# EasyEDA Pro project 3轴5.2_-专业软件格式.eprj, schematic 3轴5.2-原理图-V3.2

## Sheets
1 3轴5.2-原理图-V3.2
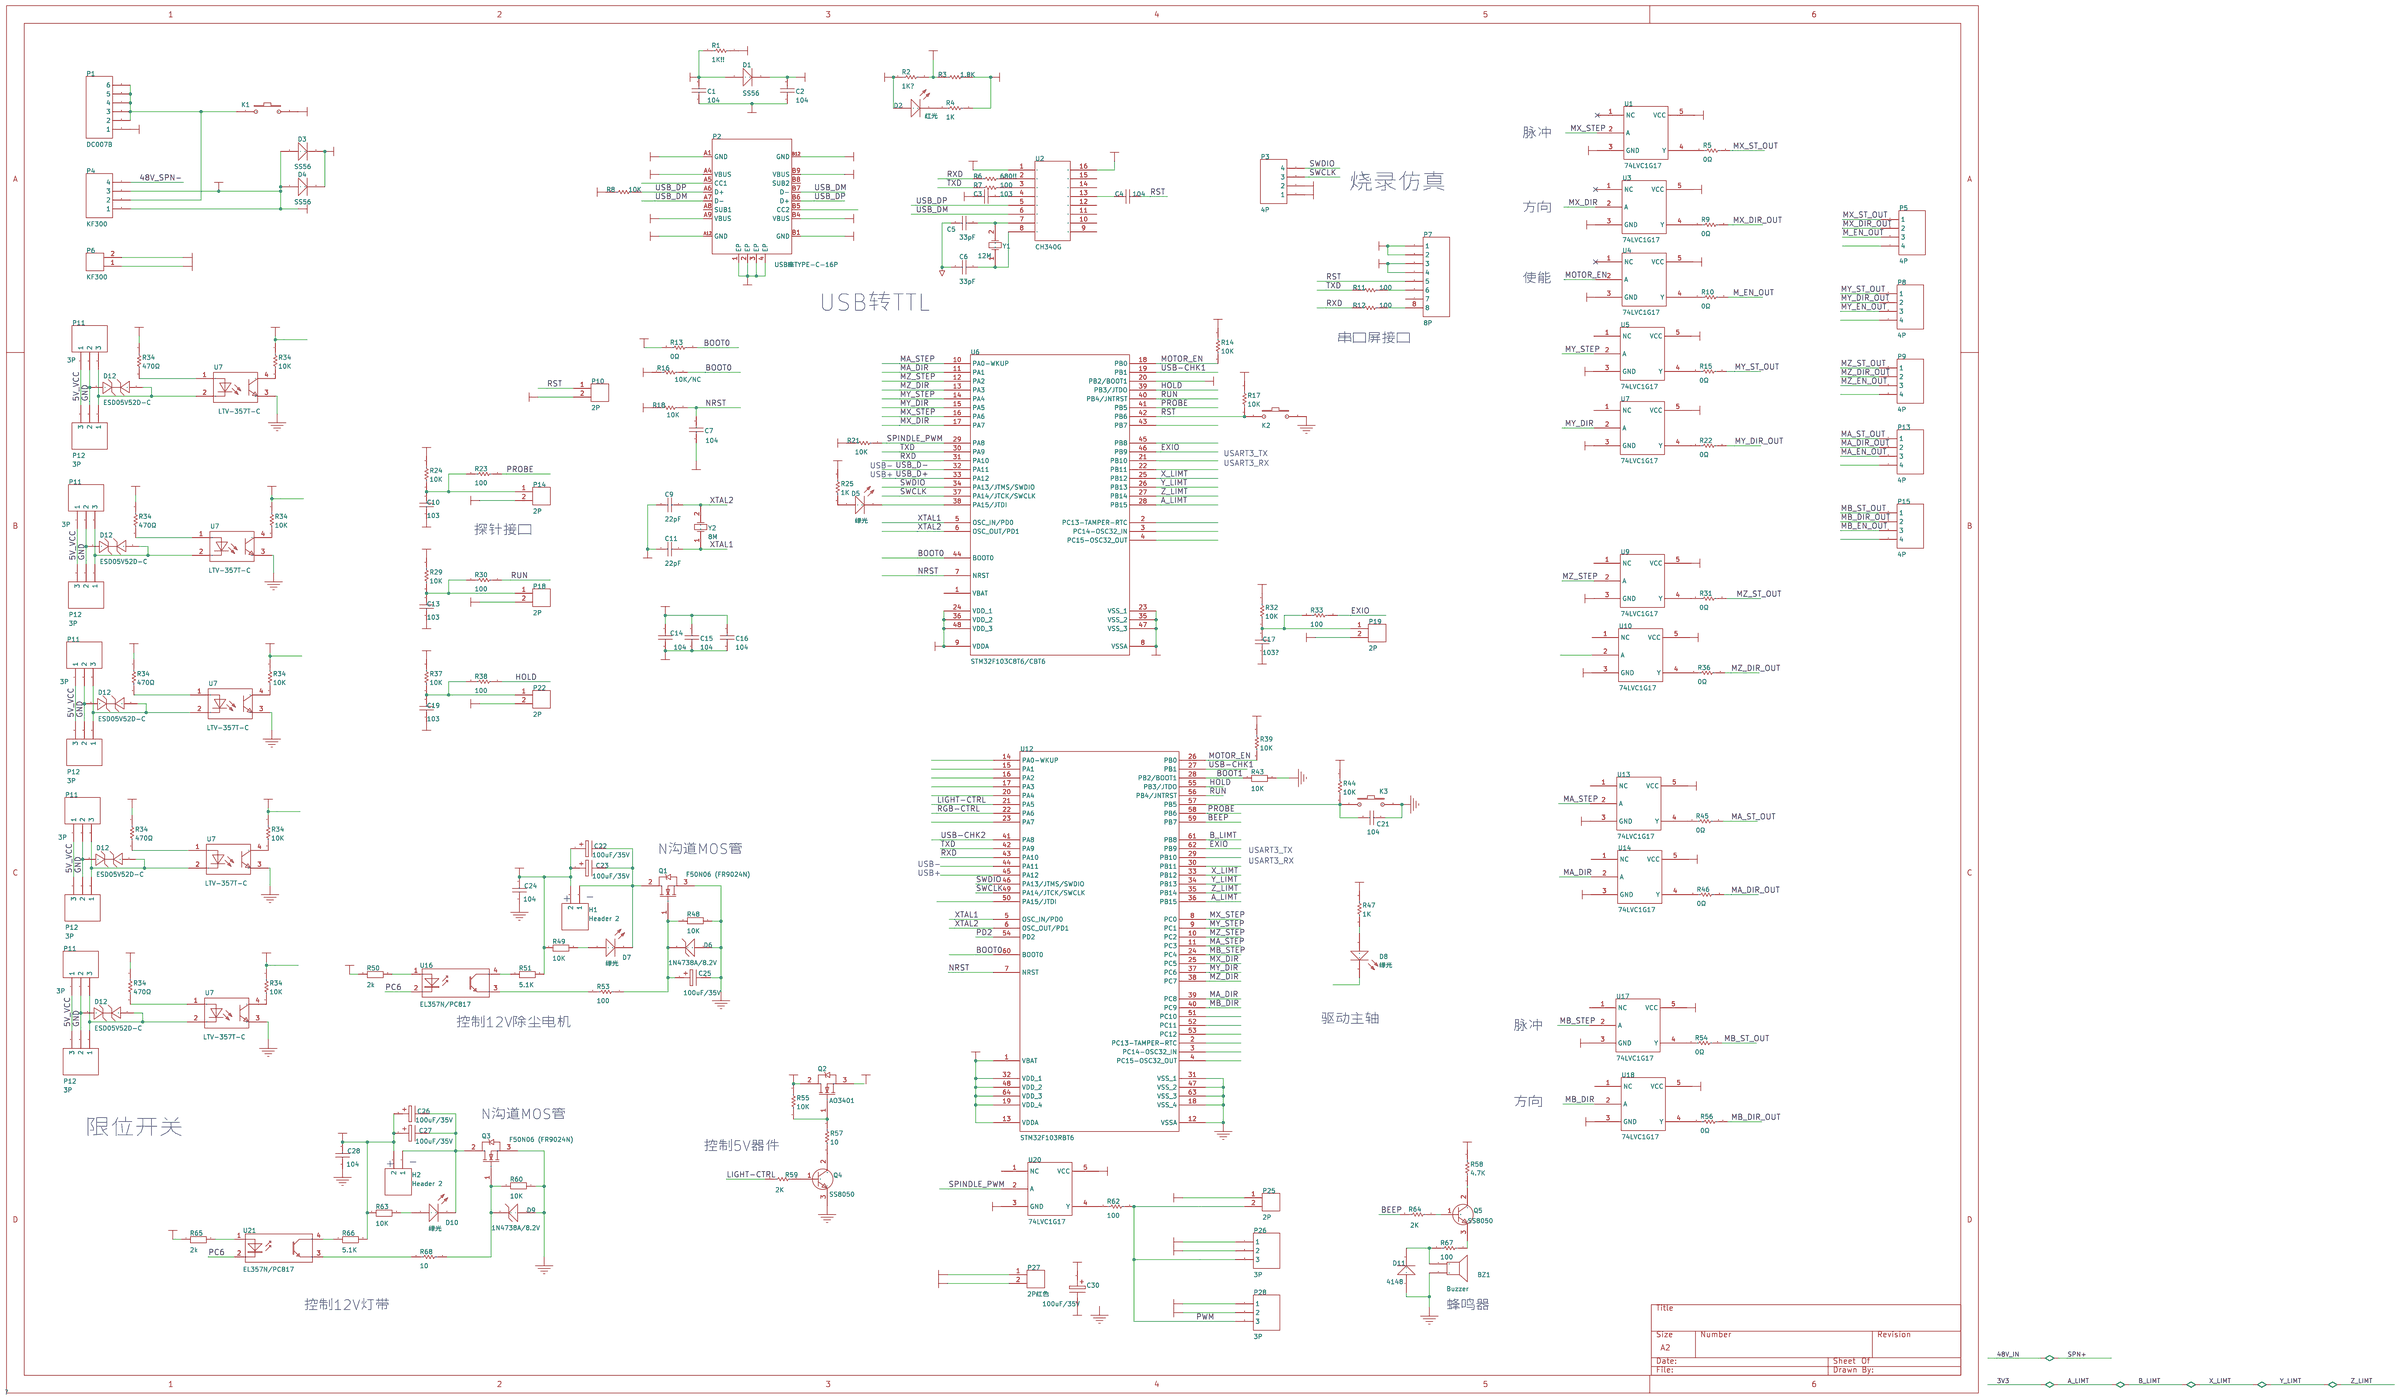
[diagram p0: 3轴5.2-原理图-V3.2]
2 电源部分
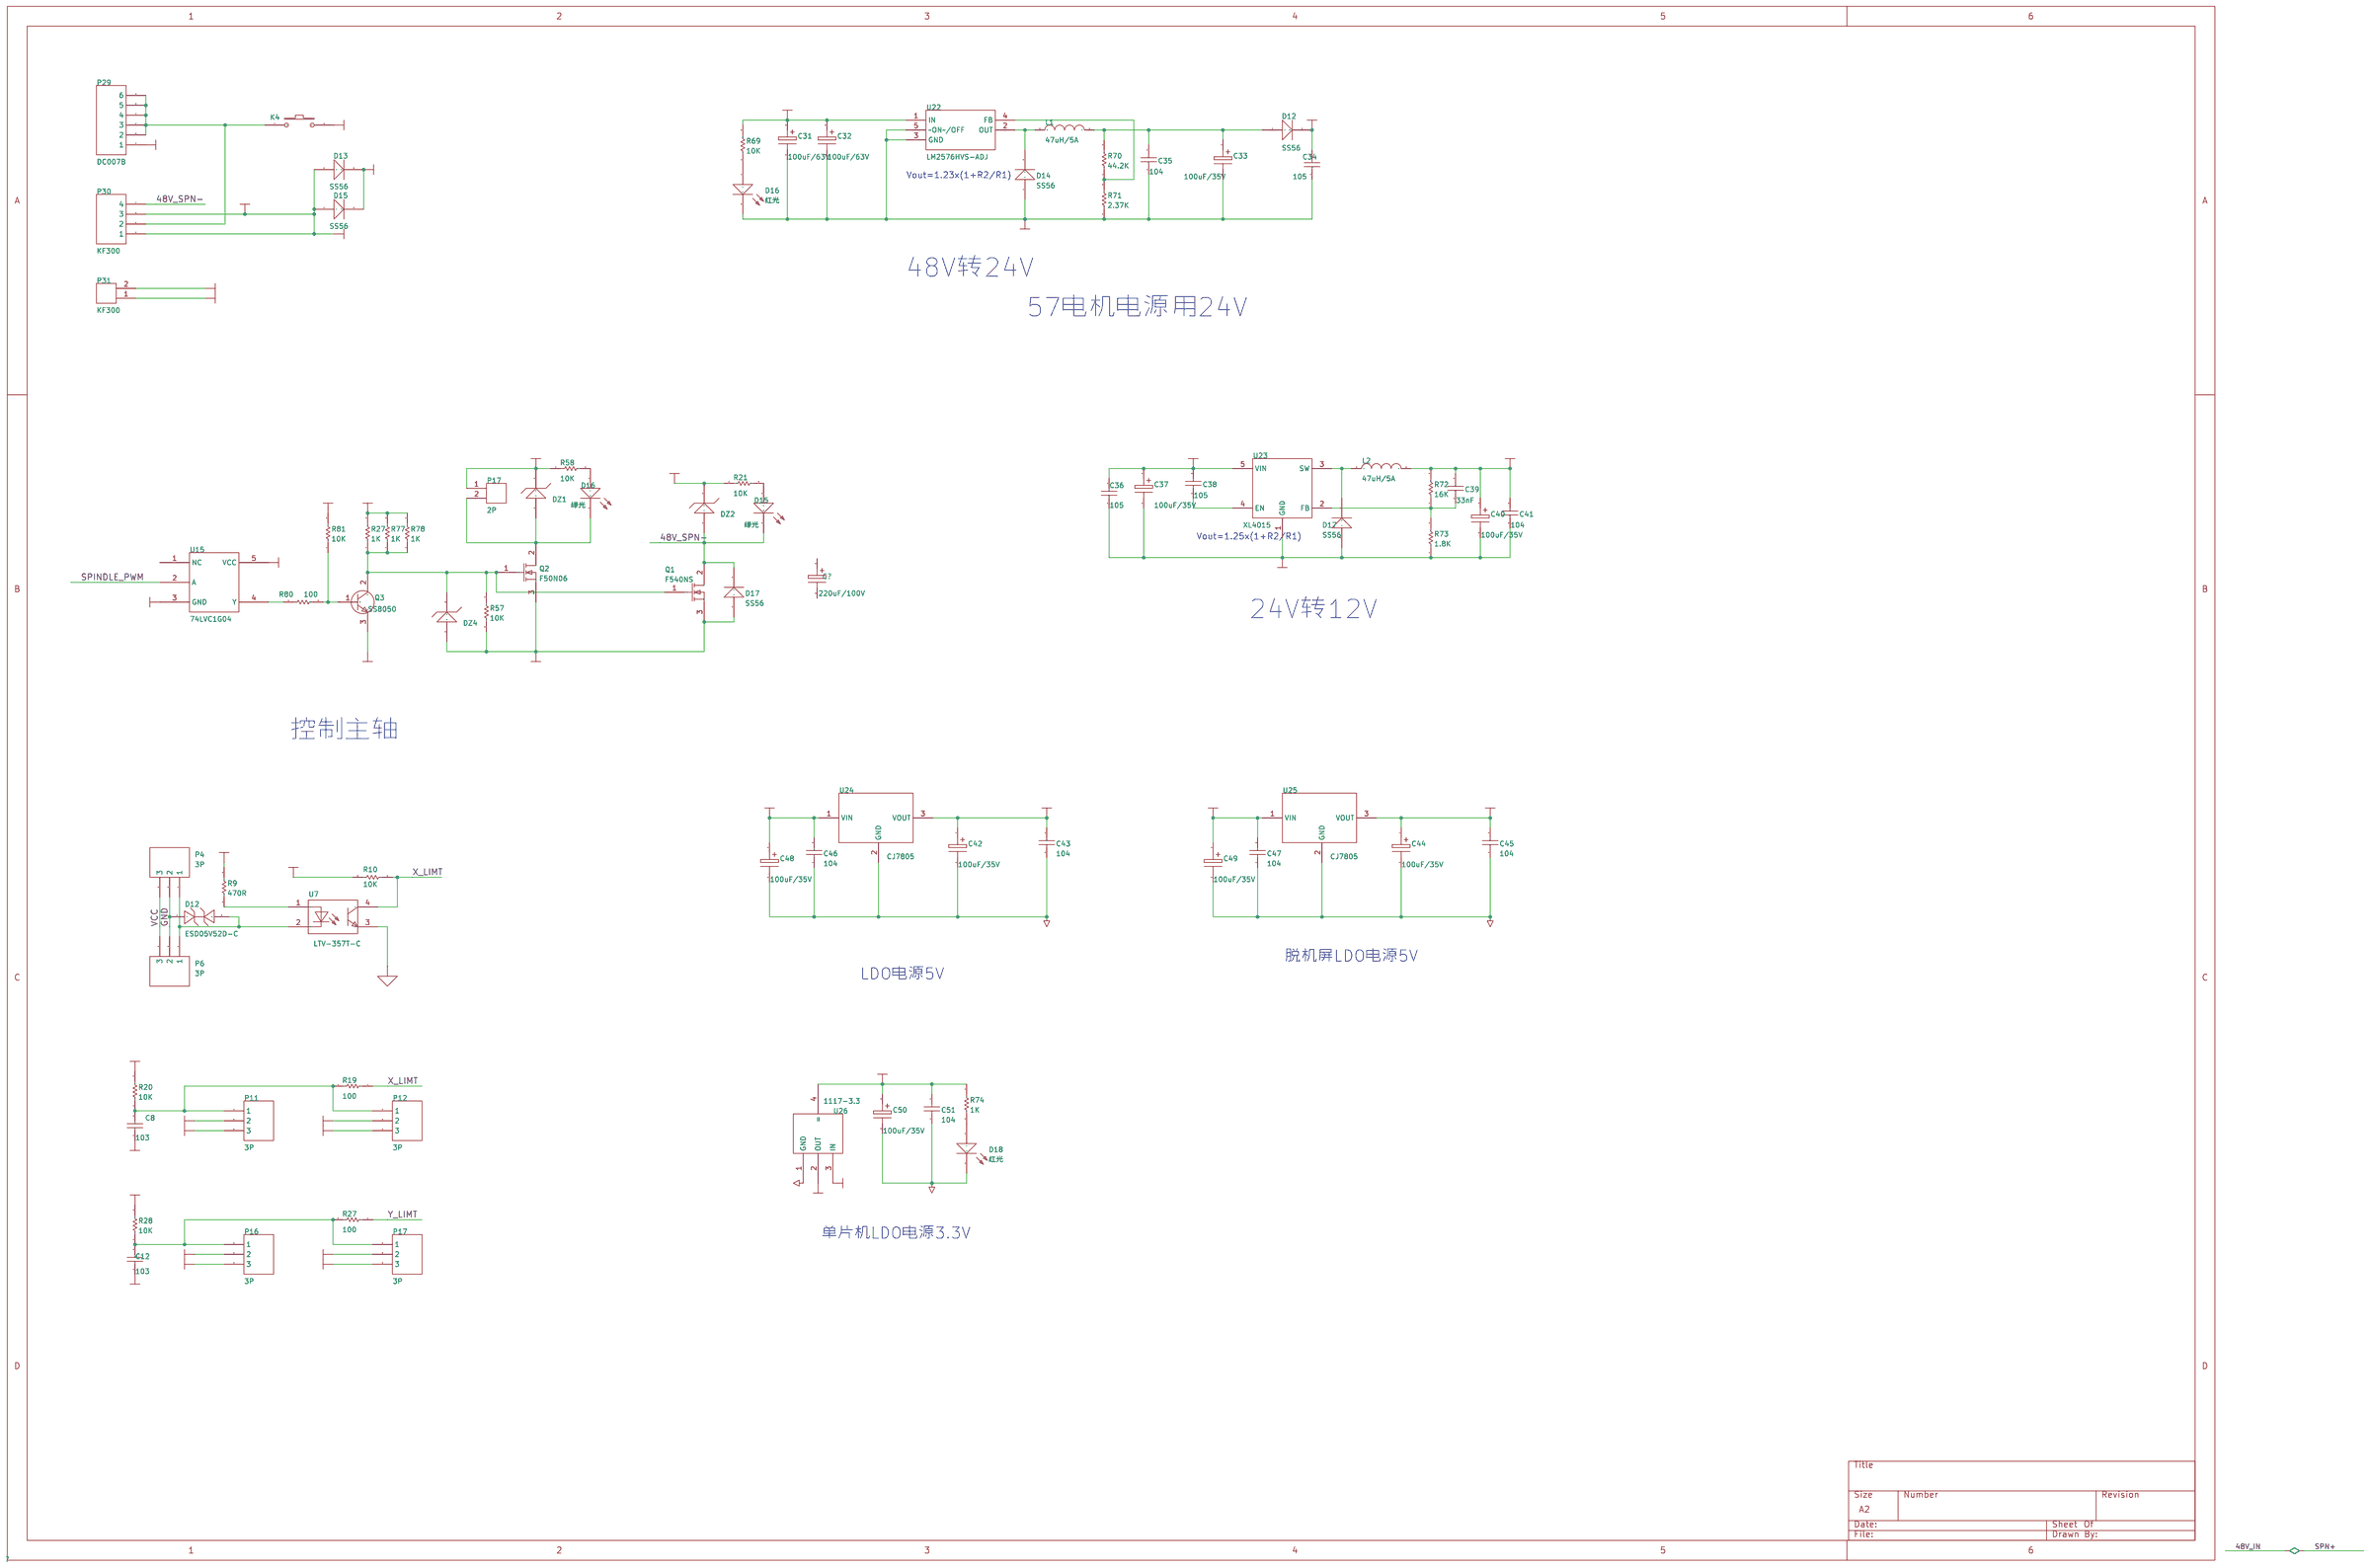
[diagram p1: 电源部分]

## Parts
sheet 3轴5.2-原理图-V3.2
BZ1  Buzzer
C1  104  [电解电容贴片10x10]
C2  104  [电解电容贴片10x10]
C3  103  [0603C]
C4  104  [0805C]
C5  18pF  [电解电容贴片6X6]
C6  18pF  [0603C]
C7  104  [电解电容贴片6X6]
C9  100pF  [0603C]
C10  103  [电解电容贴片6X6]
C11  100pF  [0603C]
C13  103  [电解电容贴片6X6]
C14  104  [0603C]
C15  104  [电解电容贴片6X6]
C16  104  [0603C]
C17  103?  [0603C]
C19  103  [0603C]
C21  104  [0603C]
C22  100uF/35V  [0603C]
C23  100uF/35V  [0603C]
C24  104  [电解电容贴片6x6]
C25  100uF/35V  [0603C]
C26  100uF/35V  [0603C]
C27  100uF/35V  [0603C]
C28  104  [0603C]
C30  100uF/35V  [0805C]
D1  SS56  [SMA]
D2  红光  [0603LED]
D3  SS56  [SMA]
D4  SS56  [0603LED]
D5  绿光  [SMA]
D6  1N4738A/8.2V  [SMA]
D7  绿光  [SMA]
D8  绿光  [0603LED]
D9  1N4738A/8.2V  [SMA]
D10  绿光  [0603LED]
D11  4148  [SMA]
D12  ESD05V52D-C
D12#2  ESD05V52D-C
D12#3  ESD05V52D-C
D12#4  ESD05V52D-C
D12#5  ESD05V52D-C
H1  Header 2
H2  Header 2
K1  开关按键  [船型开关KCD1-101]
K2  按键  [按键6x6贴片]
K3  按键  [按键6x6贴片]
P1  DC007B  [DC007B]
P2  USB座TYPE-C-16P  [直插座4P-KF300]
P3  4P  [HDR1X3_CON]
P4  KF300  [直插座4P-KF300]
P5  4P  [HDR1X2_CON]
P6  KF300  [直插座2P-KF300]
P7  8P  [HDR1X3_CON]
P8  4P  [HDR1X3_CON]
P9  4P  [HDR1X2_CON]
P10  2P  [USB_TYPEB]
P11  3P  [HDR1X3_CON]
P11#2  3P  [HDR1X3_CON]
P11#3  3P  [HDR1X3_CON]
P11#4  3P  [HDR1X3_CON]
P11#5  3P  [HDR1X3_CON]
P12  3P  [HDR1X3_CON]
P12#2  3P  [HDR1X3_CON]
P12#3  3P  [HDR1X3_CON]
P12#4  3P  [HDR1X3_CON]
P12#5  3P  [HDR1X3_CON]
P13  4P  [HDR1X2_CON]
P14  2P  [HDR1X3_CON]
P15  4P  [HDR1X4_CON]
P18  2P  [IDC8]
P19  2P  [HDR1X4_CON]
P22  2P  [HDR1X4_CON]
P25  2P  [HDR1X2_CON]
P26  3P  [HDR1X3_CON]
P27  2P红色  [直插座2P-KF300]
P28  3P  [HDR1X3_CON]
Q1  F50N06 (FR9024N)  [TO-252]
Q2  AO3401  [SOT-23]
Q3  F50N06 (FR9024N)  [TO-252]
Q4  SS8050  [SOT-23]
Q5  SS8050  [SOT-23]
R1  1K!!  [0603R]
R2  1K?  [0603R]
R3  1.8K  [0603R]
R4  1K  [0603R]
R5  0Ω  [0603R]
R6  680!!  [0603R]
R7  100  [0603R]
R8  10K  [0603R]
R9  0Ω  [0603R]
R10  0Ω  [0603R]
R11  100  [0603R]
R12  100  [0603R]
R13  0Ω  [0603R]
R14  10K  [0603R]
R15  0Ω  [0603R]
R16  10K/NC  [0603R]
R17  10K  [0603R]
R18  10K  [0603R]
R21  10K  [0603R]
R22  0Ω  [0603R]
R23  100  [0603R]
R24  10K  [0603R]
R25  1K  [0603R]
R29  10K  [0805R]
R30  100  [0805R]
R31  0Ω  [0805R]
R32  10K  [0805R]
R33  100  [0805R]
R34  10K  [0603R]
R34#2  470Ω  [0603R]
R34#3  10K  [0603R]
R34#4  470Ω  [0603R]
R34#5  10K  [0603R]
R34#6  470Ω  [0603R]
R34#7  10K  [0603R]
R34#8  470Ω  [0603R]
R34#9  10K  [0603R]
R34#10  470Ω  [0805R]
R36  0Ω  [0805R]
R37  10K  [0603R]
R38  100  [0603R]
R39  10K  [0603R]
R43  10K  [松下贴片电位器3x3]
R44  10K  [松下贴片电位器3x3]
R45  0Ω  [0603R]
R46  0Ω  [0603R]
R47  1K  [0603R]
R48  10K  [0603R]
R49  10K  [0603R]
R50  2k  [0603R]
R51  5.1K  [0603R]
R53  100  [0603R]
R54  0Ω  [0603R]
R55  10K  [0603R]
R56  0Ω  [0603R]
R57  10  [0603R]
R58  4.7K  [0603R]
R59  2K  [0603R]
R60  10K  [0603R]
R62  100  [0603R]
R63  10K  [0603R]
R64  2K  [0603R]
R65  2k  [0603R]
R66  5.1K  [0603R]
R67  100  [0603R]
R68  10  [0603R]
U1  74LVC1G17  [TO-263-2]
U2  CH340G  [TO-263]
U3  74LVC1G17  [TO-263]
U4  74LVC1G17  [LQFP48]
U5  74LVC1G17  [SOT-223]
U6  STM32F103C8T6/CBT6  [SOP16]
U7  74LVC1G17  [SOT-23-5]
U7#2  LTV-357T-C
U7#3  LTV-357T-C
U7#4  LTV-357T-C
U7#5  LTV-357T-C
U7#6  LTV-357T-C
U9  74LVC1G17  [QFN28]
U10  74LVC1G17  [QFN28]
U12  STM32F103RBT6
U13  74LVC1G17  [SOT-23-5]
U14  74LVC1G17  [SOT-23-5]
U16  EL357N/PC817  [SOT-23-5]
U17  74LVC1G17  [SOT-23-5]
U18  74LVC1G17  [SOT-23-5]
U20  74LVC1G17  [SOT-23-5]
U21  EL357N/PC817
Y1  12M  [晶振贴片49SSMD]
Y2  8M  [晶振贴片]
sheet 电源部分
C8  103  [0603C]
C12  103  [0805C]
C31  100uF/63V  [0805C]
C32  100uF/63V  [0805C]
C33  100uF/35V  [0805C]
C34  105  [电解电容贴片6X6]
C35  104  [电解电容贴片6X6]
C36  105  [电解电容贴片6X6]
C37  100uF/35V  [电解电容贴片6X6]
C38  105  [0603C]
C39  33nF  [0603C]
C40  100uF/35V  [0603C]
C41  104  [0603C]
C42  100uF/35V  [0603C]
C43  104  [0603C]
C44  100uF/35V  [0603C]
C45  104  [0603C]
C46  104  [0603C]
C47  104  [0603C]
C48  100uF/35V  [0603C]
C49  100uF/35V  [0603C]
C50  100uF/35V  [电解电容贴片6x6]
C51  104  [0603C]
C?#1  220uF/100V  [电解电容贴片6x6]
D12#6  SS56  [SMA]
D12#7  ESD05V52D-C  [0603LED]
D13  SS56  [0603LED]
D14  SS56  [SMA]
D15  SS56  [SMA]
D15#2  绿光  [0603LED]
D16  红光  [0603LED]
D16#2  绿光  [0603LED]
D17  SS56  [SMA]
D17#2  SS56  [SMA]
D18  红光  [SMA]
DZ1  快恢复二极管RS2M  [SMC]
DZ2  快恢复二极管RS2M  [SMC]
DZ4  稳压二极管SMAZ10V  [SMA]
K4  开关按键  [船型开关KCD1-101]
L1  47uH/5A  [电感贴片12X12]
L2  47uH/5A  [电感贴片12X12]
P4#2  3P  [HDR1X3_CON]
P6#2  3P  [HDR1X2_CON]
P11#6  3P  [HDR1X3_CON]
P12#6  3P  [HDR1X3_CON]
P16  3P  [HDR1X3_CON]
P17  2P  [VH3.96-2P直插座]
P17#2  3P  [VH3.96-2P直插座]
P29  DC007B  [DC007B]
P30  KF300  [HDR2X3]
P31  KF300  [直插座2P-KF300]
Q1#2  F540NS  [TO-263-2]
Q2#2  F50N06  [TO-252]
Q3#2  SS8050  [SOT-23]
R9#2  470R  [0603R]
R10#2  10K  [0603R]
R19  100  [0603R]
R20  10K  [0603R]
R21#2  10K  [0603R]
R27  1K  [0603R]
R27#2  100  [0603R]
R28  10K  [0603R]
R57#2  10K  [0603R]
R58#2  10K  [0603R]
R69  10K  [0603R]
R70  44.2K  [0603R]
R71  2.37K  [0603R]
R72  16K  [0603R]
R73  1.8K  [0603R]
R74  1K  [0603R]
R77  1K  [0603R]
R78  1K  [0603R]
R80  100  [0603R]
R81  10K  [0603R]
U7#7  LTV-357T-C
U15  74LVC1G04  [SOT-23-5]
U22  LM2576HVS-ADJ  [TO-263]
U23  XL4015  [TO-263]
U24  CJ7805  [TO-263-2]
U25  CJ7805  [TO-263-2]
U26  1117-3.3  [SOT-223]

## Library data of the parts
BZ1 = Buzzer: Loudspeaker; Published: 24-Mar-1999; LatestRevisionDate: 17-Jul-2002; LatestRevisionNote: Re-released for DXP Platform.; PackageReference: PIN2; Publisher: Altium Limited; Design Item ID: Speaker; Library Name: Miscellaneous Devices
C1 C2 C4 = 104: Capacitor (Semiconductor SIM Model); Published: 8-Jun-2000; LatestRevisionDate: 17-Jul-2002; LatestRevisionNote: Re-released for DXP Platform.; PackageReference: C1206; Publisher: Altium Limited; Origin Footprint 2: C1206; Origin Footprint 3: 0402; Origin Footprint 4: 1310[0504]; Origin Footprint 5: 1608[0603]; Origin Footprint 6: C1210; Origin Footprint 7: C0805; Origin Footprint 8: C1206; Origin Footprint 9: 0805; Origin Footprint 10: 0805L; Origin Footprint 1: 0603C; Design Item ID: Cap Semi; Library Name: Miscellaneous Devices
C3 = 103: Capacitor (Semiconductor SIM Model); Published: 8-Jun-2000; LatestRevisionDate: 17-Jul-2002; LatestRevisionNote: Re-released for DXP Platform.; PackageReference: C1206; Publisher: Altium Limited; Origin Footprint 2: C1206; Origin Footprint 3: 0402; Origin Footprint 4: 1310[0504]; Origin Footprint 5: 1608[0603]; Origin Footprint 6: C1210; Origin Footprint 7: C0805; Origin Footprint 8: C1206; Origin Footprint 9: 0805; Origin Footprint 10: 0805L; Design Item ID: Cap Semi; Library Name: Miscellaneous Devices
C5 = 33pF: Capacitor (Semiconductor SIM Model); Published: 8-Jun-2000; LatestRevisionDate: 17-Jul-2002; LatestRevisionNote: Re-released for DXP Platform.; PackageReference: C1206; Publisher: Altium Limited; Origin Footprint 2: C1206; Origin Footprint 3: 0402; Origin Footprint 4: 1310[0504]; Origin Footprint 5: 1608[0603]; Origin Footprint 6: C1210; Origin Footprint 7: C0805; Origin Footprint 8: C1206; Origin Footprint 9: 0805; Origin Footprint 10: 0805L; Origin Footprint 1: 0603C; Design Item ID: Cap Semi; Library Name: Miscellaneous Devices
C6 = 33pF: Capacitor (Semiconductor SIM Model); Published: 8-Jun-2000; LatestRevisionDate: 17-Jul-2002; LatestRevisionNote: Re-released for DXP Platform.; PackageReference: C1206; Publisher: Altium Limited; Origin Footprint 2: C1206; Origin Footprint 3: 0402; Origin Footprint 4: 1310[0504]; Origin Footprint 5: 1608[0603]; Origin Footprint 6: C1210; Origin Footprint 7: C0805; Origin Footprint 8: C1206; Origin Footprint 9: 0805; Origin Footprint 10: 0805L; Design Item ID: Cap Semi; Library Name: Miscellaneous Devices
C7 = 104: Capacitor (Semiconductor SIM Model); Published: 8-Jun-2000; LatestRevisionDate: 17-Jul-2002; LatestRevisionNote: Re-released for DXP Platform.; PackageReference: C1206; Publisher: Altium Limited; Origin Footprint 2: C1206; Origin Footprint 3: 0402; Origin Footprint 4: 1310[0504]; Origin Footprint 5: 1608[0603]; Origin Footprint 6: C1210; Origin Footprint 7: C0805; Origin Footprint 8: C1206; Origin Footprint 9: 0805; Origin Footprint 10: 0805L; Origin Footprint 11: 0805C; Origin Footprint 1: 0603C; Design Item ID: Cap Semi; Library Name: Miscellaneous Devices
C9 C11 = 22pF: Capacitor (Semiconductor SIM Model); Published: 8-Jun-2000; LatestRevisionDate: 17-Jul-2002; LatestRevisionNote: Re-released for DXP Platform.; PackageReference: C1206; Publisher: Altium Limited; Origin Footprint 2: C1206; Origin Footprint 3: 0402; Origin Footprint 4: 1310[0504]; Origin Footprint 5: 1608[0603]; Origin Footprint 6: C1210; Origin Footprint 7: C0805; Origin Footprint 8: C1206; Origin Footprint 9: 0805; Origin Footprint 10: 0805L; Origin Footprint 11: 0805C; Design Item ID: Cap Semi; Library Name: Miscellaneous Devices
C8 C10 C12 C13 C19 = 103: Design Item ID: CAP; Library Name: SCH封装库
C14 C16 C21 C28 C35 C41 = 104: Origin Footprint 2: CAP; Origin Footprint 3: 0805C; Design Item ID: CAP; Library Name: SCH封装库
C15 C24 = 104: Origin Footprint 2: CAP; Origin Footprint 3: 0805C; Origin Footprint 1: 0603C; Design Item ID: CAP; Library Name: SCH封装库
C17 = 103?: Design Item ID: CAP; Library Name: SCH封装库
C22 C23 C25-C27 C30 C33 C37 C40 C42 C44 C48 C49 = 100uF/35V: Origin Footprint 2: X47U; Origin Footprint 1: 电解电容贴片6x6; Design Item ID: ELECTRO1; Library Name: *
D1 D3 D4 D12#6 D13-D15 D17 D17#2 = SS56: Design Item ID: 1N4148; Library Name: SCH封装库
D2 D16 = 红光: Origin Footprint 2: LED(小); Design Item ID: LED; Library Name: SCH封装库
D5 D7 = 绿光: Origin Footprint 2: LED(小); Origin Footprint 1: 0603LED; Design Item ID: LED; Library Name: SCH封装库
D6 D9 = 1N4738A/8.2V: Zener Diode; Published: 8-Jun-2000; LatestRevisionDate: 17-Jul-2002; LatestRevisionNote: Re-released for DXP Platform.; PackageReference: DIODE-0.7; Publisher: Altium Limited; PackageDescription: Diode, Thru-Hole; 2 Leads; 0.7 in Pin Spacing; Design Item ID: D Zener; Library Name: Miscellaneous Devices
D8 D10 D15#2 D16#2 = 绿光: Origin Footprint 2: LED(小); Design Item ID: LED; Library Name: SCH封装库
D11 = 4148: Design Item ID: 1N4148; Library Name: SCH封装库
D12 D12#2-D12#5 D12#7 = ESD05V52D-C: 极性：双向 反向截止电压(Vrwm)：5V 击穿电压(VBR)：5.6V 钳位电压(Vc)@Ipp：15V 反向截止电压(Vrwm)：5V 击穿电压(最小值)：5.6V 峰值脉冲电流(Ipp)@tp=8/20μs：5A 最大钳位电压：15V; Supplier Part: C727170; Manufacturer: TWGMC(台湾迪嘉); Supplier Footprint: SOD-523; JLCPCB Part Class: 扩展库; Datasheet: https://atta.szlcsc.com/upload/public/pdf/source/20200827/C727170_700AFDE065FF081A69A0C04747B3686A.pdf; Supplier: LCSC
H1 H2 = Header 2: Header, 2-Pin; LatestRevisionDate: 17-Jul-2002; LatestRevisionNote: Re-released for DXP Platform.; Publisher: Altium Limited; Library Name: Miscellaneous Connectors
K1 K4 = 开关按键: Origin Footprint 2: 按键（小）; Origin Footprint 3: 侧立按键; Design Item ID: 按键; Library Name: SCH封装库
K2 K3 = 按键: Origin Footprint 2: 按键（小）; Origin Footprint 3: 侧立按键; Library Name: SCH封装库
P1 P29 = DC007B: Design Item ID: 6P; Library Name: SCH封装库
P2 = USB座TYPE-C-16P: Supplier: LCSC; Supplier Part: C709358; Manufacturer: Shenzhen Kinghelm Elec; Manufacturer Part: KH-TYPE-C-16P-T; Library Name: SCH封装库
P3 = 4P: Origin Footprint 1: SIP4; Library Name: SCH封装库
P4 P30 = KF300: Design Item ID: 4P; Library Name: SCH封装库
P5 P8 P9 P13 P15 = 4P: Library Name: SCH封装库
P6 P31 = KF300: Design Item ID: 2P; Library Name: SCH封装库
P7 = 8P: Origin Footprint 2: IDC8; Origin Footprint 1: IDC8; Library Name: SCH封装库
P10 P14 P17-P19 P22 P25 = 2P: Library Name: SCH封装库
P11 P11#2-P11#6 P12 P12#2-P12#6 P16 P17#2 P26 P28 = 3P: Library Name: SCH封装库
P27 = 2P红色: Design Item ID: 2P; Library Name: SCH封装库
Q1 Q3 = F50N06 (FR9024N): N-Channel Power MOSFET; Published: 8-Jun-2000; LatestRevisionDate: 17-Jul-2002; LatestRevisionNote: Re-released for DXP Platform.; DatasheetVersion: PD-9.814; PackageVersion: Feb-1997; PackageReference: TO-220AB; Publisher: Altium Limited; PackageDescription: TO, Thru-Hole, Vertical, Heatsink Mounted; 3 In-Line Leads; Pitch 2.54 mm; Note: Pin 2 is electrically connected to pin 4.; ComponentLink1Description: Manufacturer Link; ComponentLink1URL: http://www.irf.com/; Design Item ID: NMOS-2; Library Name: Miscellaneous Devices
Q2 = AO3401: N-Channel Power MOSFET; Published: 8-Jun-2000; LatestRevisionDate: 17-Jul-2002; LatestRevisionNote: Re-released for DXP Platform.; DatasheetVersion: PD-9.814; PackageVersion: Feb-1997; PackageReference: TO-220AB; Publisher: Altium Limited; PackageDescription: TO, Thru-Hole, Vertical, Heatsink Mounted; 3 In-Line Leads; Pitch 2.54 mm; Note: Pin 2 is electrically connected to pin 4.; ComponentLink1Description: Manufacturer Link; ComponentLink1URL: http://www.irf.com/; Origin Footprint 2: TO-252; Design Item ID: NMOS-2; Library Name: Miscellaneous Devices
Q3#2 Q4 Q5 = SS8050: Published: 8-Jun-2000; LatestRevisionDate: 17-Jul-2002; LatestRevisionNote: Re-released for DXP Platform.; PackageReference: TO-226; Publisher: Altium Limited; Code_JEDEC: TO-226-AA; Origin Footprint 2: TO-92; Design Item ID: NPN; Library Name: SCH封装库
R1 = 1K!!: Resistor; Published: 8-Jun-2000; LatestRevisionDate: 17-Jul-2002; LatestRevisionNote: Re-released for DXP Platform.; PackageReference: AXIAL-0.3; Publisher: Altium Limited; Origin Footprint 2: AXIAL-0.3; Origin Footprint 3: R0805; Design Item ID: RES; Library Name: SCH封装库
R2 = 1K?: Resistor; Published: 8-Jun-2000; LatestRevisionDate: 17-Jul-2002; LatestRevisionNote: Re-released for DXP Platform.; PackageReference: AXIAL-0.3; Publisher: Altium Limited; Origin Footprint 2: AXIAL-0.3; Origin Footprint 3: R0805; Design Item ID: RES; Library Name: SCH封装库
R3 R73 = 1.8K: Resistor; Published: 8-Jun-2000; LatestRevisionDate: 17-Jul-2002; LatestRevisionNote: Re-released for DXP Platform.; PackageReference: AXIAL-0.3; Publisher: Altium Limited; Origin Footprint 2: AXIAL-0.3; Origin Footprint 3: R0805; Design Item ID: RES; Library Name: SCH封装库
R4 = 1K: Resistor; Published: 8-Jun-2000; LatestRevisionDate: 17-Jul-2002; LatestRevisionNote: Re-released for DXP Platform.; PackageReference: AXIAL-0.3; Publisher: Altium Limited; Origin Footprint 2: AXIAL-0.3; Origin Footprint 3: R0805; Design Item ID: RES; Library Name: SCH封装库
R5 R9 R10 R15 R22 R45 R46 R54 R56 = 0Ω: Resistor; Published: 8-Jun-2000; LatestRevisionDate: 17-Jul-2002; LatestRevisionNote: Re-released for DXP Platform.; PackageReference: AXIAL-0.3; Publisher: Altium Limited; Origin Footprint 2: AXIAL-0.3; Origin Footprint 3: R0805; Origin Footprint 4: 0805R; Design Item ID: RES; Library Name: SCH封装库
R6 = 680!!: Resistor; Published: 8-Jun-2000; LatestRevisionDate: 17-Jul-2002; LatestRevisionNote: Re-released for DXP Platform.; PackageReference: AXIAL-0.3; Publisher: Altium Limited; Origin Footprint 2: AXIAL-0.3; Origin Footprint 3: R0805; Origin Footprint 4: 0805R; Design Item ID: RES; Library Name: SCH封装库
R7 R11 R12 R19 R23 R27#2 R38 R53 R62 R80 = 100: Resistor; Published: 8-Jun-2000; LatestRevisionDate: 17-Jul-2002; LatestRevisionNote: Re-released for DXP Platform.; PackageReference: AXIAL-0.3; Publisher: Altium Limited; Origin Footprint 2: AXIAL-0.3; Origin Footprint 3: R0805; Origin Footprint 4: 0805R; Design Item ID: RES; Library Name: SCH封装库
R8 = 10K: Resistor; Published: 8-Jun-2000; LatestRevisionDate: 17-Jul-2002; LatestRevisionNote: Re-released for DXP Platform.; PackageReference: AXIAL-0.3; Publisher: Altium Limited; Origin Footprint 2: AXIAL-0.3; Origin Footprint 3: R0805; Design Item ID: RES; Library Name: SCH封装库
R13 R16 R18 R21 = 10K: Resistor; Published: 8-Jun-2000; LatestRevisionDate: 17-Jul-2002; LatestRevisionNote: Re-released for DXP Platform.; PackageReference: AXIAL-0.3; Publisher: Altium Limited; Origin Footprint 2: AXIAL-0.3; Origin Footprint 3: 0805R; Origin Footprint 4: 0805R; Design Item ID: RES; Library Name: SCH封装库
R14 R39 = RES: Resistor; Published: 8-Jun-2000; LatestRevisionDate: 17-Jul-2002; LatestRevisionNote: Re-released for DXP Platform.; PackageReference: AXIAL-0.3; Publisher: Altium Limited; Origin Footprint 2: AXIAL-0.3; Origin Footprint 3: 0805R; Library Name: SCH封装库
R17 R20 R21#2 R24 R28 R34 R34#3 R34#5 R34#7 R34#9 R37 R55 R57#2 R58#2 R69 R81 = 10K: Resistor; Published: 8-Jun-2000; LatestRevisionDate: 17-Jul-2002; LatestRevisionNote: Re-released for DXP Platform.; PackageReference: AXIAL-0.3; Publisher: Altium Limited; Origin Footprint 2: AXIAL-0.3; Origin Footprint 3: R0805; Origin Footprint 4: 0805R; Design Item ID: RES; Library Name: SCH封装库
R25 R27 R47 R74 R77 R78 = 1K: Resistor; Published: 8-Jun-2000; LatestRevisionDate: 17-Jul-2002; LatestRevisionNote: Re-released for DXP Platform.; PackageReference: AXIAL-0.3; Publisher: Altium Limited; Origin Footprint 2: AXIAL-0.3; Origin Footprint 3: R0805; Origin Footprint 4: 0805R; Design Item ID: RES; Library Name: SCH封装库
R29 R32 = 10K: Resistor; Published: 8-Jun-2000; LatestRevisionDate: 17-Jul-2002; LatestRevisionNote: Re-released for DXP Platform.; PackageReference: AXIAL-0.3; Publisher: Altium Limited; Origin Footprint 2: AXIAL-0.3; Origin Footprint 3: R0805; Origin Footprint 1: 0603R; Design Item ID: RES; Library Name: SCH封装库
R30 R33 = 100: Resistor; Published: 8-Jun-2000; LatestRevisionDate: 17-Jul-2002; LatestRevisionNote: Re-released for DXP Platform.; PackageReference: AXIAL-0.3; Publisher: Altium Limited; Origin Footprint 2: AXIAL-0.3; Origin Footprint 3: R0805; Origin Footprint 1: 0603R; Design Item ID: RES; Library Name: SCH封装库
R31 R36 = 0Ω: Resistor; Published: 8-Jun-2000; LatestRevisionDate: 17-Jul-2002; LatestRevisionNote: Re-released for DXP Platform.; PackageReference: AXIAL-0.3; Publisher: Altium Limited; Origin Footprint 2: AXIAL-0.3; Origin Footprint 3: R0805; Origin Footprint 1: 0603R; Design Item ID: RES; Library Name: SCH封装库
R34#2 R34#4 R34#6 R34#8 = 470Ω: Resistor; Published: 8-Jun-2000; LatestRevisionDate: 17-Jul-2002; LatestRevisionNote: Re-released for DXP Platform.; PackageReference: AXIAL-0.3; Publisher: Altium Limited; Origin Footprint 2: AXIAL-0.3; Origin Footprint 3: R0805; Origin Footprint 4: 0805R; Design Item ID: RES; Library Name: SCH封装库
R34#10 = 470Ω: Resistor; Published: 8-Jun-2000; LatestRevisionDate: 17-Jul-2002; LatestRevisionNote: Re-released for DXP Platform.; PackageReference: AXIAL-0.3; Publisher: Altium Limited; Origin Footprint 2: AXIAL-0.3; Origin Footprint 3: R0805; Origin Footprint 1: 0603R; Design Item ID: RES; Library Name: SCH封装库
R43 = 10K: Origin Footprint 2: res; Origin Footprint 3: RES2; Origin Footprint 4: AXIAL-0.4; Origin Footprint 1: 0805R; Design Item ID: res; Library Name: MYLIB
R44 = 10K: Resistor; Published: 8-Jun-2000; LatestRevisionDate: 17-Jul-2002; LatestRevisionNote: Re-released for DXP Platform.; PackageReference: AXIAL-0.3; Publisher: Altium Limited; Origin Footprint 2: AXIAL-0.3; Origin Footprint 3: R0805; Origin Footprint 4: 0805R; Origin Footprint 1: 0603R; Design Item ID: RES; Library Name: SCH封装库
R48 R49 R60 R63 = 10K: Origin Footprint 2: res; Origin Footprint 3: RES2; Origin Footprint 4: AXIAL-0.4; Origin Footprint 5: 0805R; Design Item ID: res; Library Name: MYLIB
R50 R65 = 2k: Origin Footprint 2: res; Origin Footprint 3: RES2; Origin Footprint 4: AXIAL-0.4; Origin Footprint 5: 0805R; Design Item ID: res; Library Name: MYLIB
R51 R66 = 5.1K: Origin Footprint 2: res; Origin Footprint 3: RES2; Origin Footprint 4: AXIAL-0.4; Origin Footprint 5: 0805R; Design Item ID: res; Library Name: MYLIB
R57 = 10: Resistor; Published: 8-Jun-2000; LatestRevisionDate: 17-Jul-2002; LatestRevisionNote: Re-released for DXP Platform.; PackageReference: AXIAL-0.3; Publisher: Altium Limited; Origin Footprint 2: AXIAL-0.3; Origin Footprint 3: R0805; Design Item ID: RES; Library Name: SCH封装库
R58 = 4.7K: Resistor; Published: 8-Jun-2000; LatestRevisionDate: 17-Jul-2002; LatestRevisionNote: Re-released for DXP Platform.; PackageReference: AXIAL-0.3; Publisher: Altium Limited; Origin Footprint 2: AXIAL-0.3; Origin Footprint 3: R0805; Origin Footprint 4: 0805R; Design Item ID: RES; Library Name: SCH封装库
R59 R64 = 2K: Resistor; Published: 8-Jun-2000; LatestRevisionDate: 17-Jul-2002; LatestRevisionNote: Re-released for DXP Platform.; PackageReference: AXIAL-0.3; Publisher: Altium Limited; Origin Footprint 2: AXIAL-0.3; Origin Footprint 3: R0805; Design Item ID: RES; Library Name: SCH封装库
R67 = 100: Resistor; Published: 8-Jun-2000; LatestRevisionDate: 17-Jul-2002; LatestRevisionNote: Re-released for DXP Platform.; PackageReference: AXIAL-0.3; Publisher: Altium Limited; Origin Footprint 2: AXIAL-0.3; Origin Footprint 3: R0805; Design Item ID: RES; Library Name: SCH封装库
R68 = 10: Resistor; Published: 8-Jun-2000; LatestRevisionDate: 17-Jul-2002; LatestRevisionNote: Re-released for DXP Platform.; PackageReference: AXIAL-0.3; Publisher: Altium Limited; Origin Footprint 2: AXIAL-0.3; Origin Footprint 3: R0805; Origin Footprint 4: 0805R; Design Item ID: RES; Library Name: SCH封装库
U1 U3-U5 U7 U9 U10 U13 U14 U17 U18 U20 = 74LVC1G17: Library Name: SCH封装库
U2 = CH340G: Design Item ID: DIP16; Library Name: SCH封装库
U6 = STM32F103C8T6/CBT6: STM32 ARM-based 32-bit MCU with 32 Kbytes Flash, 48-pin LQFP, Industrial Temperature; Published: *; DatasheetVersion: *; PackageVersion: *; PackageReference: *; Publisher: *; PackageDescription: *; ComponentLink1Description: *; ComponentLink1URL: *; ComponentLink2Description: *; ComponentLink2URL: *; Origin Footprint 2: LQFP48_L; Origin Footprint 3: LQFP48_M; Origin Footprint 1: LQFP48; Design Item ID: STM32F103C6T6; Library Name: ST Microcontroller 32-Bit STM32 SCH
U7#2-U7#7 = LTV-357T-C: 输入电压类型:DC;正向电压:1.2V;输出电流:50mA;隔离电压(rms):3.75kV;反向电压:6V;接收端电压:35V;输出通道数:1;集射极饱和电压(Vce(sat)@Ic,IF):200mV@1mA,20mA;; Supplier: LCSC; Manufacturer: LITEON(光宝); Supplier Part: C119091; JLCPCB Part Class: 扩展库; LCSC Part Name: DC输入隔离电压(rms):3750V; Supplier Footprint: SOP-4-2.54mm; Datasheet: https://atta.szlcsc.com/upload/public/pdf/source/20170930/C133128_1506736380934997376.pdf; Input voltage type: DC; Output Type: 光电三极管; Forward Voltage: 1.2V; Output Current: 50mA; Isolation Voltage(rms): 3.75kV; Reverse Voltage: 6V; Receiving End Voltage: 35V; Number of Outputs: 1; Collector-Emitter Saturation Voltage (Vce(sat)@Ic,IF): 200mV@1mA,20mA; Rise time: 4us@2mA,100Ω; Fall time: 3us@2mA,100Ω; Operating Temperature: -55℃~+110℃
U12 = STM32F103RBT6: STM32 ARM-based 32-bit MCU with 128 Kbytes Flash, 64-pin LQFP, Industrial Temperature; Published: 30-May-2008; DatasheetVersion: rev6, Mar-2008; PackageVersion: Mar-2008; PackageReference: LQFP64; Publisher: Altium Limited; PackageDescription: 64-Pin Low-Profile Quad Flat Pack, 10 x 10 mm Body, 0.5 mm Pitch (LQFP64); ComponentLink1Description: Manufacturer Link; ComponentLink1URL: www.st.com/stm32; ComponentLink2Description: Datasheet; ComponentLink2URL: http://www.st.com/stonline/products/literature/ds/13587.pdf; Origin Footprint 2: LQFP64_L; Origin Footprint 3: LQFP64_M; Origin Footprint 1: LQFP-64; Library Name: ST Microcontroller 32-Bit STM32; Datasheet: http://www.st.com/stonline/products/literature/ds/13587.pdf
U16 U21 = EL357N/PC817: 4-Pin Phototransistor Optocoupler; Published: 24-Mar-1999; LatestRevisionDate: 04-Mar-2005; LatestRevisionNote: Sch pins 3 &amp; 4 Swapped.; DatasheetVersion: Nov-2003; PackageReference: DIP-4; Publisher: Altium Limited; Design Item ID: Optoisolator1; Library Name: Miscellaneous Devices
Y1 = 12M: Crystal Oscillator; Published: 8-Jun-2000; LatestRevisionDate: 17-Jul-2002; LatestRevisionNote: Re-released for DXP Platform.; PackageReference: R38; Publisher: Altium Limited; Origin Footprint 2: R38; Origin Footprint 3: XTAL-49S; Design Item ID: XTAL; Library Name: Miscellaneous Devices
Y2 = 8M: Crystal Oscillator; Published: 8-Jun-2000; LatestRevisionDate: 17-Jul-2002; LatestRevisionNote: Re-released for DXP Platform.; PackageReference: R38; Publisher: Altium Limited; Origin Footprint 2: R38; Origin Footprint 3: XTAL-49S; Design Item ID: XTAL; Library Name: Miscellaneous Devices
C31 C32 = 100uF/63V: Origin Footprint 2: X47U; Origin Footprint 1: 电解电容贴片10x10; Design Item ID: ELECTRO1; Library Name: *
C34 C36 C38 = 105: Design Item ID: CAP; Library Name: SCH封装库
C39 = 33nF: Design Item ID: CAP; Library Name: SCH封装库
C43 C45-C47 C51 = 104: Capacitor (Semiconductor SIM Model); Published: 8-Jun-2000; LatestRevisionDate: 17-Jul-2002; LatestRevisionNote: Re-released for DXP Platform.; PackageReference: C1206; Publisher: Altium Limited; Origin Footprint 2: C1206; Origin Footprint 3: 0402; Origin Footprint 4: 1310[0504]; Origin Footprint 5: 1608[0603]; Origin Footprint 6: C1210; Origin Footprint 7: C0805; Origin Footprint 8: C1206; Origin Footprint 9: 0805; Origin Footprint 10: 0805L; Design Item ID: Cap Semi; Library Name: Miscellaneous Devices
C50 = 100uF/35V: Origin Footprint 2: X47U; Design Item ID: ELECTRO1; Library Name: *
C?#1 = 220uF/100V: Origin Footprint 2: X47U; Design Item ID: ELECTRO1; Library Name: *
D18 = 红光: Origin Footprint 2: LED(小); Origin Footprint 1: 0603LED; Design Item ID: LED; Library Name: SCH封装库
DZ1 DZ2 = 快恢复二极管RS2M: Design Item ID: 稳压二极管; Library Name: SCH封装库
DZ4 = 稳压二极管SMAZ10V: Design Item ID: 稳压二极管; Library Name: SCH封装库
L1 L2 = 47uH/5A: Inductor; Published: 8-Jun-2000; LatestRevisionDate: 29-May-2009; LatestRevisionNote: IPC-7351 Footprint Added.; PackageReference: 0402-A; Publisher: Altium Limited; PackageDescription: Chip Inductor; Code_JEITA: 0402; Code_IEC: 1005; Origin Footprint 2: INDC1608L; Origin Footprint 3: INDC2012L; Origin Footprint 4: INDC0603L; Origin Footprint 5: INDC3216AL; Origin Footprint 6: INDC4532L; Origin Footprint 1: 电感贴片12x12; Design Item ID: Inductor; Library Name: SCH封装库
P4#2 P6#2 = 3P: Library Name: SCH--װ--
Q1#2 = F540NS: N-Channel MOSFET; Published: 8-Jun-2000; LatestRevisionDate: 17-Jul-2002; LatestRevisionNote: Re-released for DXP Platform.; PackageVersion: 1995/1996; PackageReference: E3; Publisher: Altium Limited; Design Item ID: MOSFET-N; Library Name: SCH封装库
Q2#2 = F50N06: N-Channel MOSFET; Published: 8-Jun-2000; LatestRevisionDate: 17-Jul-2002; LatestRevisionNote: Re-released for DXP Platform.; PackageVersion: 1995/1996; PackageReference: E3; Publisher: Altium Limited; Design Item ID: MOSFET-N; Library Name: SCH封装库
R9#2 = 470R: Resistor; Published: 8-Jun-2000; LatestRevisionDate: 17-Jul-2002; LatestRevisionNote: Re-released for DXP Platform.; PackageReference: AXIAL-0.3; Publisher: Altium Limited; Origin Footprint 2: AXIAL-0.3; Origin Footprint 3: R0805; Origin Footprint 4: 0805R; Design Item ID: RES; Library Name: SCH--װ--
R10#2 = 10K: Resistor; Published: 8-Jun-2000; LatestRevisionDate: 17-Jul-2002; LatestRevisionNote: Re-released for DXP Platform.; PackageReference: AXIAL-0.3; Publisher: Altium Limited; Origin Footprint 2: AXIAL-0.3; Origin Footprint 3: R0805; Origin Footprint 4: 0805R; Design Item ID: RES; Library Name: SCH--װ--
R70 = 44.2K: Resistor; Published: 8-Jun-2000; LatestRevisionDate: 17-Jul-2002; LatestRevisionNote: Re-released for DXP Platform.; PackageReference: AXIAL-0.3; Publisher: Altium Limited; Origin Footprint 2: AXIAL-0.3; Origin Footprint 3: R0805; Design Item ID: RES; Library Name: SCH封装库
R71 = 2.37K: Resistor; Published: 8-Jun-2000; LatestRevisionDate: 17-Jul-2002; LatestRevisionNote: Re-released for DXP Platform.; PackageReference: AXIAL-0.3; Publisher: Altium Limited; Origin Footprint 2: AXIAL-0.3; Origin Footprint 3: R0805; Design Item ID: RES; Library Name: SCH封装库
R72 = 16K: Resistor; Published: 8-Jun-2000; LatestRevisionDate: 17-Jul-2002; LatestRevisionNote: Re-released for DXP Platform.; PackageReference: AXIAL-0.3; Publisher: Altium Limited; Origin Footprint 2: AXIAL-0.3; Origin Footprint 3: R0805; Design Item ID: RES; Library Name: SCH封装库
U15 = 74LVC1G04: Design Item ID: 74LVC1G17; Library Name: SCH封装库
U22 = LM2576HVS-ADJ: Simple Switcher 3A Step Down Voltage Regulator; Published: 15-Apr-2002; DatasheetVersion: Jun-1999; PackageReference: TS5B; Publisher: Altium Limited; PackageDescription: D2-PAK; 5 Leads; Body 14.4 (inc. leads) x 10.4 mm (LxW max); Note: Tab is connected to GND; ComponentLink1Description: Manufacturer Link; ComponentLink1URL: http://www.national.com/; ComponentLink2Description: Datasheet; ComponentLink2URL: http://www.national.com/ds.cgi/LM/LM2576.pdf; ComponentLink3Description: URL Link1; ComponentLink3URL: http://www.national.com/pf/LM/LM2576.html; Design Item ID: LM2576S-5.0; Library Name: NSC Power Mgt Switching Regulator; Datasheet: http://www.national.com/ds.cgi/LM/LM2576.pdf
U23 = XL4015: Design Item ID: XL4005; Library Name: SCH封装库
U24 U25 = CJ7805: Design Item ID: 7805; Library Name: SCH封装库
U26 = 1117-3.3: Design Item ID: LM1117; Library Name: Party600

## Nets
3V3: C14.2 C15.2 C16.2 C50.1 C51.2 P3.2 R10#2.1 R10#2.2 R13.2 R14.2 R17.1 R18.1 R19.1 R20.2 R24.2 R25.2 R27#2.1 R28.2 R29.2 R32.2 R34.1 R34#3.1 R34#5.1 R34#7.1 R34#9.1 R37.2 R39.2 R44.1 R47.2 R50.1 R65.1 R74.1 U6.9(VDDA) U6.24(VDD_1) U6.25(PB12) U6.26(PB13) U6.27(PB14) U6.28(PB15) U6.36(VDD_2) U6.48(VDD_3) U7#7.4 U12.33(PB12) U12.34(PB13) U12.35(PB14) U12.36(PB15) U12.61(PB8) U26.2(OUT) U26.4(=)
5V_DIS: C44.1 C45.2 U25.3(VOUT)
5V_VCC: C2.2 C42.1 C43.2 D1.2 P7.1 P7.2 P11.1 P11#2.1 P11#3.1 P11#4.1 P11#5.1 P11#6.3 P12.3 P12#2.3 P12#3.3 P12#4.3 P12#5.3 P12#6.3 P16.3 P17#2.3 Q2.2(D) R34#2.1 R34#4.1 R34#6.1 R34#8.1 R34#10.1 R55.2 U1.5(VCC) U2.16 U3.5(VCC) U4.5(VCC) U5.5(VCC) U7.5(VCC) U9.5(VCC) U10.5(VCC) U13.5(VCC) U14.5(VCC) U17.5(VCC) U18.5(VCC) U20.5(VCC) U24.3(VOUT)
12V: C22.1 C23.1 C24.2 C26.1 C27.1 C28.2 C30.1 C39.2 C40.1 C41.2 C46.2 C47.2 C48.1 C49.1 H1.2 H2.2 L2.2 P26.1 P27.2 R27.2 R49.1 R51.2 R63.1 R66.2 R72.2 R77.2 R78.2 U24.1(VIN) U25.1(VIN)
24V: C34.1 C36.1 C37.1 C38.2 D12#6.2 DZ1.2 P1.1 P6.1 P17.1 P28.1 P29.1 P31.1 R58#2.1 U23.5(VIN)
48V1: C31.1 C32.1 D3.2 D4.2 D13.2 D15.2 R69.2 U22.1(IN)
48V_IN: D3.1 D4.1 D13.1 D15.1 DZ2.2 P4.1 P4.3 P30.1 P30.3 R21#2.1
48V_SPN-: D15#2.2 D17#2.2 DZ2.1 P4.4 P30.4 Q1#2.2(D)
GND: BZ1.2 C1.1 C2.1 C3.2 C5.2 C6.2 C7.1 C8.1 C9.2 C10.1 C11.2 C12.1 C13.1 C14.1 C15.1 C16.1 C17.1 C19.1 C21.1 C24.1 C25.2 C28.1 C30.2 C31.2 C32.2 C33.2 C34.2 C35.1 C36.2 C37.2 C40.2 C41.1 C42.2 C43.1 C44.2 C45.1 C46.1 C47.1 C48.2 C49.2 C50.2 C51.1 D6.1(A) D9.1(A) D11.1 D12.1 D12#2.1 D12#3.1 D12#4.1 D12#5.1 D12#7.1 D14.1 D16.2 D17.1 D17#2.1 D18.2 DZ4.1 K1.2 K2.2 K3.2 K4.2 P2.1(EP) P2.2(EP) P2.3(EP) P2.4(EP) P2.A1(GND) P2.A12(GND) P2.B1(GND) P2.B12(GND) P3.1 P4#2.2 P6.2 P6#2.2 P7.3 P7.4 P10.2 P11.2 P11#2.2 P11#3.2 P11#4.2 P11#5.2 P11#6.2 P12.2 P12#2.2 P12#3.2 P12#4.2 P12#5.2 P12#6.2 P14.2 P16.2 P17#2.2 P18.2 P19.2 P22.2 P25.1 P26.2 P27.1 P28.2 P31.2 Q1.3(S) Q1#2.3(S) Q2#2.3(S) Q3.3(S) Q3#2.3(E) Q4.3(E) R1.1 R3.2 R4.1 R16.1 R21.1 R43.2 R48.1 R57#2.2 R60.1 R71.1 R73.1 U1.3(GND) U2.1 U3.3(GND) U4.3(GND) U5.3(GND) U6.8(VSSA) U6.20(PB2/BOOT1) U6.23(VSS_1) U6.35(VSS_2) U6.47(VSS_3) U7.3(GND) U7#2.3 U7#3.3 U7#4.3 U7#5.3 U7#6.3 U9.3(GND) U10.3(GND) U12.12(VSSA) U12.18(VSS_4) U12.31(VSS_1) U12.47(VSS_2) U12.63(VSS_3) U13.3(GND) U14.3(GND) U15.3(GND) U17.3(GND) U18.3(GND) U20.3(GND) U22.3(GND) U22.5(~ON~/OFF) U23.1(GND) U24.2(GND) U25.2(GND) U26.1(GND)
PGND: U7#7.3
V3-3: U12.1(VBAT) U12.13(VDDA) U12.19(VDD_4) U12.32(VDD_1) U12.48(VDD_2) U12.64(VDD_3)
VCC: P4#2.3 P6#2.3 R9#2.2 R81.2 U15.5(VCC) U26.3(IN)
BEEP: R64.2 U12.59(PB7)
BOOT0: R13.1 R16.2 U6.44(BOOT0) U12.60(BOOT0)
BOOT1: R43.1 U12.28(PB2/BOOT1)
EXIO: R33.1 U6.46(PB9) U12.62(PB9)
HOLD: R38.1 U6.39(PB3/JTDO) U12.55(PB3/JTDO)
LIGHT-CTRL: R59.2 U12.21(PA5)
M_EN_OUT: P5.3 R10.2
MA_DIR: U6.11(PA1) U12.39(PC8) U14.2(A)
MA_DIR_OUT: P13.2 R46.2
MA_EN_OUT: P13.3
MA_ST_OUT: P13.1 R45.2
MA_STEP: U6.10(PA0-WKUP) U12.11(PC3) U13.2(A)
MB_DIR: U12.40(PC9) U18.2(A)
MB_DIR_OUT: P15.2 R56.2
MB_EN_OUT: P15.3
MB_ST_OUT: P15.1 R54.2
MB_STEP: U12.24(PC4) U17.2(A)
MOTOR_EN: R14.1 R39.1 U4.2(A) U6.18(PB0) U12.26(PB0)
MX_DIR: U3.2(A) U6.17(PA7) U12.25(PC5)
MX_DIR_OUT: P5.2 R9.2
MX_ST_OUT: P5.1 R5.2
MX_STEP: U1.2(A) U6.16(PA6) U12.8(PC0)
MY_DIR: U6.15(PA5) U7.2(A) U12.37(PC6)
MY_DIR_OUT: P8.2 R22.2
MY_EN_OUT: P8.3
MY_ST_OUT: P8.1 R15.2
MY_STEP: U5.2(A) U6.14(PA4) U12.9(PC1)
MZ_DIR: U6.13(PA3) U12.38(PC7)
MZ_DIR_OUT: P9.2 R36.2
MZ_EN_OUT: P9.3
MZ_ST_OUT: P9.1 R31.2
MZ_STEP: U6.12(PA2) U9.2(A) U12.10(PC2)
NRST: C7.2 R18.2 U6.7(NRST) U12.7(NRST)
PC6: U16.2(K) U21.2(K)
PD2: U12.54(PD2)
PROBE: R23.1 U6.41(PB5) U12.58(PB6)
PWM: P25.2 P26.3 P28.3 R62.2
RGB-CTRL: U12.22(PA6)
RST: C4.2 K2.1 P7.5 P10.1 R17.2 U6.42(PB6)
RUN: R30.1 U6.40(PB4/JNTRST) U12.56(PB4/JNTRST)
RXD: R6.2 R12.1 U6.31(PA10) U12.43(PA10)
SPINDLE_PWM: R21.2 U6.29(PA8) U15.2(A) U20.2(A)
SWCLK: P3.3 U6.37(PA14/JTCK/SWCLK) U12.49(PA14/JTCK/SWCLK)
SWDIO: P3.4 U6.34(PA13/JTMS/SWDIO) U12.46(PA13/JTMS/SWDIO)
TXD: R7.2 R11.1 U6.30(PA9) U12.42(PA9)
USB-CHK1: R2.2 R3.1 U6.19(PB1) U12.27(PB1)
USB-CHK2: U12.41(PA8)
USB_D+: U6.33(PA12)
USB_D-: U6.32(PA11)
USB_DM: P2.A7(D-) P2.B7(D-) U2.6
USB_DP: P2.A6(D+) P2.B6(D+) R8.2 U2.5
VUSB: C1.2 D1.1 D2.1 P2.A4(VBUS) P2.A9(VBUS) P2.B4(VBUS) P2.B9(VBUS) R1.2 R2.1 R8.1
XTAL1: C11.1 U6.5(OSC_IN/PD0) U12.5(OSC_IN/PD0) Y2.1(OSC1)
XTAL2: C9.1 U6.6(OSC_OUT/PD1) U12.6(OSC_OUT/PD1) Y2.2(OSC2)
Net-(BZ1-1): BZ1.1 D11.2 R67.2
Net-(C3-1): C3.1 U2.4
Net-(C4-1): C4.1 U2.13
Net-(C5-1): C5.1 U2.7 Y1.2(OSC2)
Net-(C6-1): C6.1 U2.8 Y1.1(OSC1)
Net-(C8-2): C8.2 P11#6.1 P12#6.1 R19.2 R20.1
Net-(C10-2): C10.2 P14.1 R23.2 R24.1
Net-(C12-2): C12.2 P16.1 P17#2.1 R27#2.2 R28.1
Net-(C13-2): C13.2 P18.1 R29.1 R30.2
Net-(C17-2): C17.2 P19.1 R32.1 R33.2
Net-(C19-2): C19.2 P22.1 R37.1 R38.2
Net-(C21-2): C21.2 K3.1 R44.2 U12.57(PB5)
Net-(C22-2): C22.2 C23.2 D7.2 H1.1 Q1.2(D)
Net-(C25-1): C25.1 D6.2(K) Q1.1(G) R48.2 R53.1
Net-(C26-2): C26.2 C27.2 D10.2 H2.1 Q3.2(D)
Net-(C33-1): C33.1 C35.2 D12#6.1 L1.2 R70.2
Net-(C38-1): C38.1 U23.4(EN)
Net-(C39-1): C39.1 R72.1 R73.2 U23.2(FB)
Net-(D2-2): D2.2 R4.2
Net-(D5-1): D5.1 R25.1
Net-(D5-2): D5.2 U6.38(PA15/JTDI)
Net-(D7-1): D7.1 R49.2
Net-(D8-1): D8.1 R47.1
Net-(D9-2): D9.2(K) Q3.1(G) R60.2 R68.1
Net-(D10-1): D10.1 R63.2
Net-(D12#2-2): D12#2.2 P11#2.3 P12#2.1 U7#3.2
Net-(D12#3-2): D12#3.2 P11#3.3 P12#3.1 U7#4.2
Net-(D12#4-2): D12#4.2 P11#4.3 P12#4.1 U7#5.2
Net-(D12#5-2): D12#5.2 P11#5.3 P12#5.1 U7#6.2
Net-(D12#7-2): D12#7.2 P4#2.1 P6#2.1 U7#7.2
Net-(D12-2): D12.2 P11.3 P12.1 U7#2.2
Net-(D14-2): D14.2 L1.1 U22.2(OUT)
Net-(D15#2-1): D15#2.1 R21#2.2
Net-(D16#2-1): D16#2.1 R58#2.2
Net-(D16#2-2): D16#2.2 DZ1.1 P17.2 Q2#2.2(D)
Net-(D16-1): D16.1 R69.1
Net-(D17-2): D17.2 L2.1 U23.3(SW)
Net-(D18-1): D18.1 R74.2
Net-(DZ4-2): DZ4.2 Q1#2.1(G) Q2#2.1(G) Q3#2.2(C) R27.1 R57#2.1 R77.1 R78.1
Net-(K1-1): K1.1 P1.2 P1.3 P1.4 P1.5 P1.6 P4.2
Net-(K4-1): K4.1 P29.2 P29.3 P29.4 P29.5 P29.6 P30.2
Net-(P7-6): P7.6 R11.2
Net-(P7-8): P7.8 R12.2
Net-(Q2-1): Q2.1(G) R55.1 R57.1
Net-(Q3#2-1): Q3#2.1(B) R80.2 R81.1
Net-(Q4-1): Q4.1(B) R59.1
Net-(Q5-1): Q5.1(B) R64.1
Net-(Q5-2): Q5.2(C) R58.1
Net-(Q5-3): Q5.3(E) R67.1
Net-(R5-1): R5.1 U1.4(Y)
Net-(R6-1): R6.1 U2.2
Net-(R7-1): R7.1 U2.3
Net-(R9#2-1): R9#2.1 U7#7.1
Net-(R9-1): R9.1 U3.4(Y)
Net-(R10-1): R10.1 U4.4(Y)
Net-(R15-1): R15.1 U5.4(Y)
Net-(R22-1): R22.1 U7.4(Y)
Net-(R31-1): R31.1 U9.4(Y)
Net-(R34#2-2): R34#2.2 U7#2.1
Net-(R34#3-2): R34#3.2 U7#3.4
Net-(R34#4-2): R34#4.2 U7#3.1
Net-(R34#5-2): R34#5.2 U7#4.4
Net-(R34#6-2): R34#6.2 U7#4.1
Net-(R34#7-2): R34#7.2 U7#5.4
Net-(R34#8-2): R34#8.2 U7#5.1
Net-(R34#9-2): R34#9.2 U7#6.4
Net-(R34#10-2): R34#10.2 U7#6.1
Net-(R34-2): R34.2 U7#2.4
Net-(R36-1): R36.1 U10.4(Y)
Net-(R45-1): R45.1 U13.4(Y)
Net-(R46-1): R46.1 U14.4(Y)
Net-(R50-2): R50.2 U16.1(A)
Net-(R51-1): R51.1 U16.4(C)
Net-(R53-2): R53.2 U16.3(E)
Net-(R54-1): R54.1 U17.4(Y)
Net-(R56-1): R56.1 U18.4(Y)
Net-(R62-1): R62.1 U20.4(Y)
Net-(R65-2): R65.2 U21.1(A)
Net-(R66-1): R66.1 U21.4(C)
Net-(R68-2): R68.2 U21.3(E)
Net-(R70-1): R70.1 R71.2 U22.4(FB)
NETR80_1: R80.1 U15.4(Y)

Not connected (* = marked no-connect by the designer): C?#1 1 2; D8 2; P2 A5(CC1) A8(SUB1) B5(CC2) B8(SUB2); P5 4; P7 7; P8 4; P9 4; P13 4; P15 4; Q2 3(S); Q4 2(C); R57 2; R58 2; U1 1(NC)*; U2 9 10 11 12 14 15; U3 1(NC)*; U4 1(NC)*; U5 1(NC); U6 1(VBAT) 2(PC13-TAMPER-RTC) 3(PC14-OSC32_IN) 4(PC15-OSC32_OUT) 21(PB10) 22(PB11) 43(PB7) 45(PB8); U7 1(NC); U9 1(NC); U10 1(NC) 2(A); U12 2(PC13-TAMPER-RTC) 3(PC14-OSC32_IN) 4(PC15-OSC32_OUT) 14(PA0-WKUP) 15(PA1) 16(PA2) 17(PA3) 20(PA4) 23(PA7) 29(PB10) 30(PB11) 44(PA11) 45(PA12) 50(PA15/JTDI) 51(PC10) 52(PC11) 53(PC12); U13 1(NC); U14 1(NC); U15 1(NC); U17 1(NC); U18 1(NC); U20 1(NC)

## Notes on the sheets
sheet 1
- 脉冲
- 烧录仿真
- 方向
- 使能
- USB转TTL
- 串口屏接口
- USART3_TX
- USB-
- USART3_RX
- USB+
- 探针接口
- N沟道MOS管
- USART3_TX
- USART3_RX
- USB+
- USB-
- +
- -
- 控制12V除尘电机
- 驱动主轴
- 脉冲
- 方向
- N沟道MOS管
- 限位开关
- 控制5V器件
- +
- -
- 控制12V灯带
- 蜂鸣器
sheet 2
- Vout=1.23x(1+R2/R1)
- 48V转24V
- 57电机电源用24V
- Vout=1.25x(1+R2/R1)
- 24V转12V
- 控制主轴
- 脱机屏LDO电源5V
- LDO电源5V
- 单片机LDO电源3.3V
